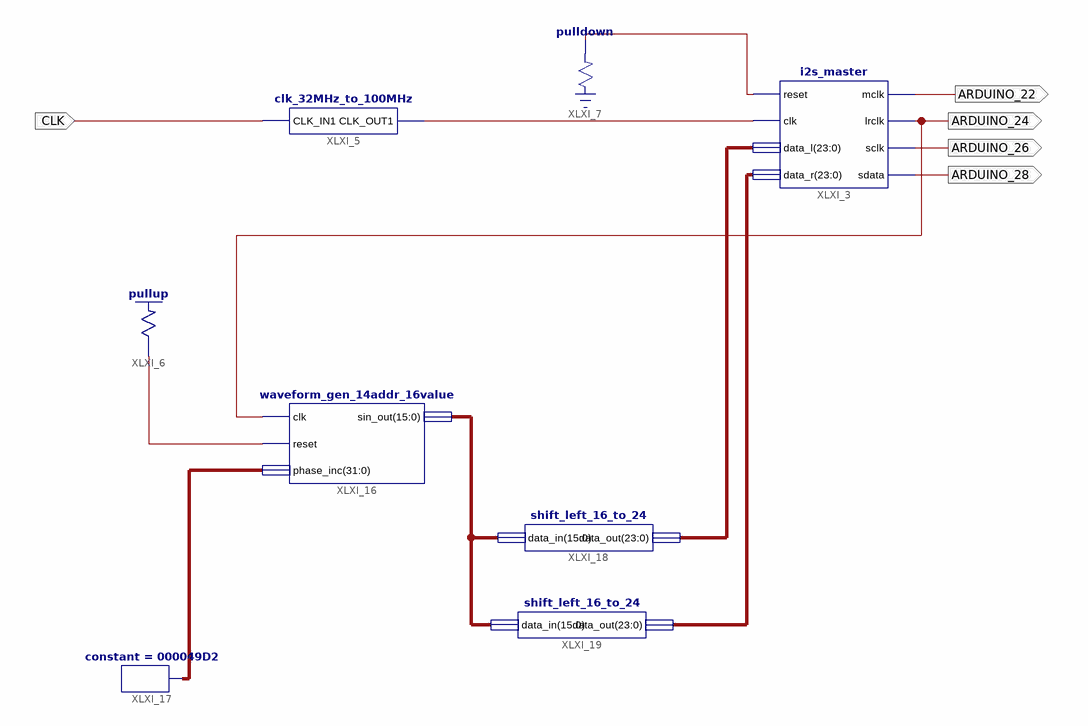
[diagram p0: schematic sheet 1]
// Xilinx ISE schematic Papilio_Audio_Modular_top.sch (spartan6) as structural Verilog: 8 symbols, 5 ports
module Papilio_Audio_Modular_top (
  input  CLK,
  output ARDUINO_22,
  output ARDUINO_24,
  output ARDUINO_26,
  output ARDUINO_28
);

  wire XLXN_5, XLXN_6, XLXN_15;
  wire [15:0] XLXN_52;
  wire [23:0] XLXN_53, XLXN_54;
  wire [31:0] XLXN_42;

  clk_32MHz_to_100MHz XLXI_5 (.CLK_IN1(CLK), .CLK_OUT1(XLXN_5));
  \pullup  XLXI_6 (.O(XLXN_6));
  i2s_master XLXI_3 (
    .reset(XLXN_15), .clk(XLXN_5), .data_l(XLXN_53), .data_r(XLXN_54), .mclk(ARDUINO_22), .lrclk(ARDUINO_24),
    .sclk(ARDUINO_26), .sdata(ARDUINO_28));
  \pulldown  XLXI_7 (.O(XLXN_15));
  waveform_gen_14addr_16value XLXI_16 (.clk(ARDUINO_24), .reset(XLXN_6), .phase_inc(XLXN_42), .sin_out(XLXN_52));
  constant #(.CValue("000049D2")) XLXI_17 (.O(XLXN_42));
  shift_left_16_to_24 XLXI_18 (.data_in(XLXN_52), .data_out(XLXN_53));
  shift_left_16_to_24 XLXI_19 (.data_in(XLXN_52), .data_out(XLXN_54));
endmodule
